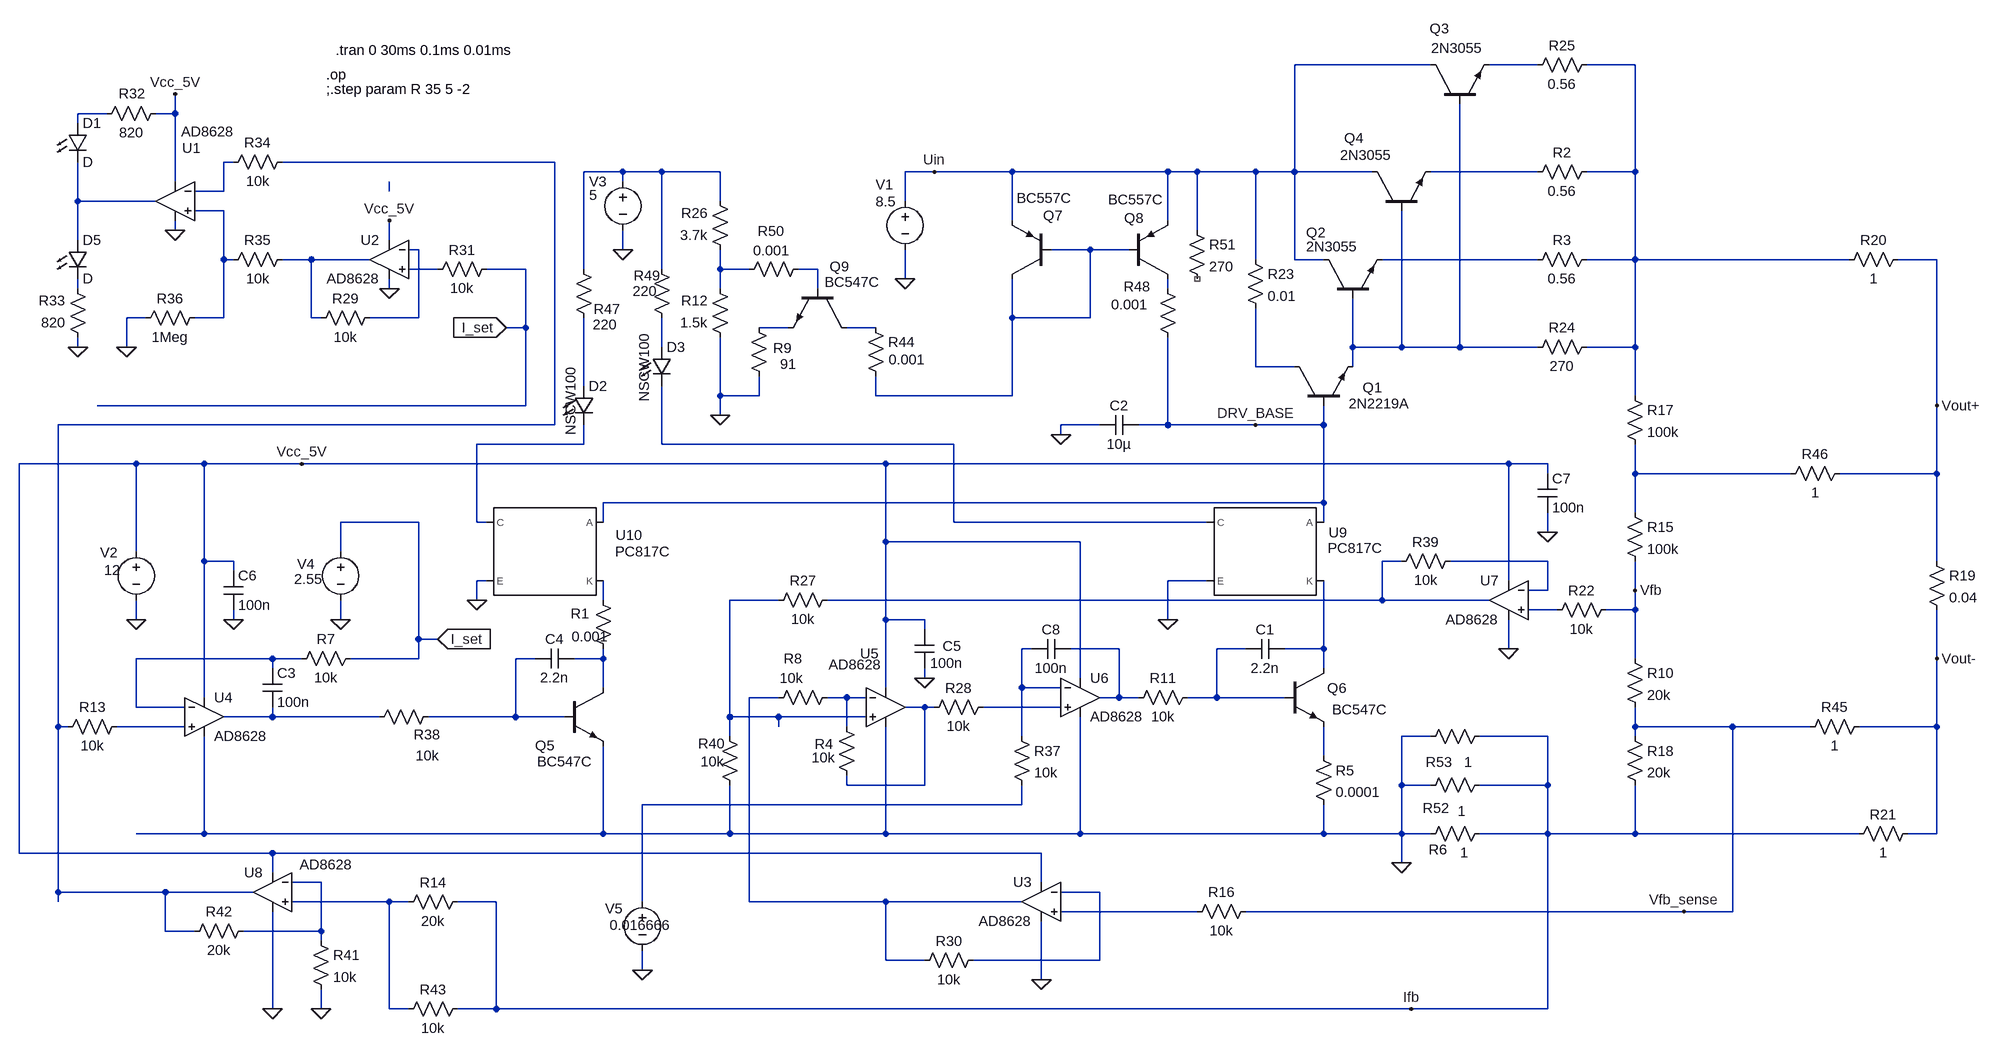
[diagram p0: schematic PSU1.17_LowSide_CurrentLimit_optoUIreg.asc]
PSU1.17_LowSide_CurrentLimit_optoUIreg.asc, the LTspice schematic file:
Version 4
SHEET 1 1588 1488
WIRE 352 -112 128 -112
WIRE 528 -112 448 -112
WIRE 688 -112 608 -112
WIRE -1824 -32 -1872 -32
WIRE -1712 -32 -1712 -64
WIRE -1712 -32 -1744 -32
WIRE -1872 -16 -1872 -32
WIRE -1616 48 -1632 48
WIRE -1088 48 -1536 48
WIRE -976 64 -1040 64
WIRE -912 64 -976 64
WIRE -816 64 -912 64
WIRE -464 64 -512 64
WIRE -336 64 -464 64
WIRE -80 64 -336 64
WIRE -32 64 -80 64
WIRE 64 64 -32 64
WIRE 128 64 128 -112
WIRE 128 64 64 64
WIRE 256 64 128 64
WIRE 528 64 352 64
WIRE 688 64 688 -112
WIRE 688 64 608 64
WIRE -1712 80 -1712 -32
WIRE -976 80 -976 64
WIRE -1632 96 -1632 48
WIRE -1632 96 -1680 96
WIRE -1360 96 -1360 80
WIRE -1872 112 -1872 48
WIRE -1744 112 -1872 112
WIRE -816 112 -816 64
WIRE -512 112 -512 64
WIRE -1632 128 -1680 128
WIRE -336 144 -336 64
WIRE -80 144 -80 64
WIRE -1712 160 -1712 144
WIRE -32 160 -32 64
WIRE -1872 176 -1872 112
WIRE -1360 176 -1360 144
WIRE -1312 192 -1328 192
WIRE -976 192 -976 160
WIRE -208 192 -272 192
WIRE -144 192 -208 192
WIRE -1632 208 -1632 128
WIRE -1616 208 -1632 208
WIRE -1488 208 -1536 208
WIRE -1392 208 -1488 208
WIRE 64 208 64 64
WIRE 128 208 128 64
WIRE 176 208 128 208
WIRE 528 208 272 208
WIRE 688 208 688 64
WIRE 688 208 608 208
WIRE 1040 208 688 208
WIRE 1184 208 1120 208
WIRE -1280 224 -1328 224
WIRE -1136 224 -1200 224
WIRE -1040 224 -1040 64
WIRE -912 224 -912 64
WIRE -816 224 -816 192
WIRE -768 224 -816 224
WIRE -656 224 -688 224
WIRE -512 240 -512 192
WIRE -1872 256 -1872 240
WIRE -1360 256 -1360 240
WIRE -816 256 -816 224
WIRE -656 256 -656 224
WIRE -80 256 -80 240
WIRE -1760 304 -1792 304
WIRE -1632 304 -1632 208
WIRE -1632 304 -1680 304
WIRE -1488 304 -1488 208
WIRE -1472 304 -1488 304
WIRE -1312 304 -1312 192
WIRE -1312 304 -1392 304
WIRE -336 304 -336 240
WIRE -208 304 -208 192
WIRE -208 304 -336 304
WIRE -1136 320 -1136 224
WIRE -1136 320 -1168 320
WIRE -704 320 -752 320
WIRE -560 320 -608 320
WIRE -1872 352 -1872 336
WIRE -1792 352 -1792 304
WIRE -912 352 -912 304
WIRE 224 352 224 272
WIRE 304 352 304 128
WIRE 304 352 224 352
WIRE 400 352 400 -48
WIRE 400 352 304 352
WIRE 528 352 400 352
WIRE 688 352 688 208
WIRE 688 352 608 352
WIRE 64 384 64 288
WIRE 128 384 64 384
WIRE 224 384 224 352
WIRE -1040 416 -1040 304
WIRE -816 432 -816 336
WIRE -752 432 -752 400
WIRE -752 432 -816 432
WIRE -560 432 -560 400
WIRE -336 432 -336 304
WIRE -336 432 -560 432
WIRE 688 432 688 352
WIRE -1136 448 -1136 320
WIRE -1136 448 -1840 448
WIRE 1184 448 1184 208
WIRE -816 464 -816 432
WIRE -1088 480 -1088 48
WIRE -1088 480 -1904 480
WIRE -192 480 -256 480
WIRE -80 480 -80 336
WIRE -80 480 -128 480
WIRE 64 480 -80 480
WIRE 176 480 176 448
WIRE 176 480 64 480
WIRE -256 496 -256 480
WIRE -1040 512 -1040 480
WIRE -1040 512 -1216 512
WIRE -912 512 -912 416
WIRE -432 512 -912 512
WIRE -1776 544 -1968 544
WIRE -1664 544 -1776 544
WIRE -1504 544 -1664 544
WIRE -544 544 -1504 544
WIRE 480 544 -544 544
WIRE 544 544 480 544
WIRE 544 560 544 544
WIRE 688 560 688 512
WIRE 944 560 688 560
WIRE 1184 560 1184 448
WIRE 1184 560 1024 560
WIRE 176 608 176 480
WIRE 176 608 -1008 608
WIRE 688 624 688 560
WIRE -1312 640 -1440 640
WIRE -1216 640 -1216 512
WIRE -1200 640 -1216 640
WIRE -1008 640 -1008 608
WIRE -432 640 -432 512
WIRE -16 640 -432 640
WIRE 176 640 176 608
WIRE 544 656 544 624
WIRE -544 672 -544 544
WIRE -224 672 -544 672
WIRE -1776 688 -1776 544
WIRE -1440 688 -1440 640
WIRE -1664 704 -1664 544
WIRE -1616 704 -1664 704
WIRE 304 704 272 704
WIRE 544 704 384 704
WIRE 1184 704 1184 560
WIRE -1616 720 -1616 704
WIRE -1200 736 -1216 736
WIRE -16 736 -80 736
WIRE 480 736 480 544
WIRE 544 752 544 704
WIRE 544 752 512 752
WIRE 688 752 688 704
WIRE -1216 768 -1216 736
WIRE -1008 768 -1008 736
WIRE -720 768 -800 768
WIRE 272 768 272 704
WIRE 272 768 -640 768
WIRE 448 768 272 768
WIRE 560 784 512 784
WIRE 688 784 688 752
WIRE 688 784 640 784
WIRE -1776 800 -1776 768
WIRE -1616 800 -1616 784
WIRE -1440 800 -1440 768
WIRE -544 800 -544 672
WIRE -480 800 -544 800
WIRE -80 800 -80 736
WIRE -480 816 -480 800
WIRE -1312 832 -1312 640
WIRE -1280 832 -1312 832
WIRE -304 848 -320 848
WIRE -160 848 -240 848
WIRE 48 848 0 848
WIRE 176 848 176 736
WIRE 176 848 112 848
WIRE 480 848 480 800
WIRE -1552 864 -1776 864
WIRE -1504 864 -1552 864
WIRE -1312 864 -1312 832
WIRE -1312 864 -1424 864
WIRE -1120 864 -1152 864
WIRE -1008 864 -1008 848
WIRE -1008 864 -1056 864
WIRE 688 864 688 784
WIRE 1184 864 1184 784
WIRE -1552 880 -1552 864
WIRE 176 880 176 848
WIRE -480 896 -480 880
WIRE -224 896 -224 672
WIRE -1008 912 -1008 864
WIRE -544 912 -544 800
WIRE -320 912 -320 848
WIRE -256 912 -320 912
WIRE -1664 928 -1664 704
WIRE -720 928 -768 928
WIRE -608 928 -640 928
WIRE -576 928 -608 928
WIRE -160 928 -160 848
WIRE -160 928 -192 928
WIRE -128 928 -160 928
WIRE 0 928 0 848
WIRE 0 928 -48 928
WIRE 112 928 0 928
WIRE -1776 944 -1776 864
WIRE -1696 944 -1776 944
WIRE -480 944 -512 944
WIRE -464 944 -480 944
WIRE -256 944 -384 944
WIRE -1552 960 -1552 944
WIRE -1552 960 -1632 960
WIRE -1376 960 -1552 960
WIRE -1152 960 -1152 864
WIRE -1152 960 -1296 960
WIRE -1072 960 -1152 960
WIRE -800 960 -800 768
WIRE -720 960 -800 960
WIRE -576 960 -720 960
WIRE -1904 976 -1904 480
WIRE -1888 976 -1904 976
WIRE -1696 976 -1808 976
WIRE -720 976 -720 960
WIRE -608 976 -608 928
WIRE 688 976 688 944
WIRE 848 976 688 976
WIRE 976 976 848 976
WIRE 1184 976 1184 864
WIRE 1184 976 1056 976
WIRE -800 992 -800 960
WIRE -320 992 -320 912
WIRE 352 992 304 992
WIRE 544 992 432 992
WIRE 688 992 688 976
WIRE 176 1024 176 976
WIRE -608 1072 -608 1056
WIRE -480 1072 -480 944
WIRE -480 1072 -608 1072
WIRE 304 1072 304 992
WIRE 352 1072 304 1072
WIRE 544 1072 544 992
WIRE 544 1072 432 1072
WIRE -320 1104 -320 1072
WIRE -320 1104 -944 1104
WIRE -1664 1152 -1664 992
WIRE -1664 1152 -1776 1152
WIRE -1008 1152 -1008 1008
WIRE -1008 1152 -1664 1152
WIRE -800 1152 -800 1072
WIRE -800 1152 -1008 1152
WIRE -544 1152 -544 976
WIRE -544 1152 -800 1152
WIRE -224 1152 -224 960
WIRE -224 1152 -544 1152
WIRE 176 1152 176 1104
WIRE 176 1152 -224 1152
WIRE 304 1152 304 1072
WIRE 304 1152 176 1152
WIRE 352 1152 304 1152
WIRE 544 1152 544 1072
WIRE 544 1152 432 1152
WIRE 688 1152 688 1072
WIRE 688 1152 544 1152
WIRE 1056 1152 688 1152
WIRE 1184 1152 1184 976
WIRE 1184 1152 1136 1152
WIRE -1968 1184 -1968 544
WIRE -1552 1184 -1968 1184
WIRE -288 1184 -1552 1184
WIRE 304 1200 304 1152
WIRE -1552 1216 -1552 1184
WIRE -1472 1232 -1520 1232
WIRE -288 1232 -288 1184
WIRE -1904 1248 -1904 976
WIRE -1728 1248 -1904 1248
WIRE -1584 1248 -1728 1248
WIRE -192 1248 -256 1248
WIRE -1904 1264 -1904 1248
WIRE -1360 1264 -1520 1264
WIRE -1328 1264 -1360 1264
WIRE -1184 1264 -1248 1264
WIRE -944 1264 -944 1104
WIRE -768 1264 -768 928
WIRE -544 1264 -768 1264
WIRE -320 1264 -544 1264
WIRE -32 1280 -256 1280
WIRE 768 1280 48 1280
WIRE 848 1280 848 976
WIRE 848 1280 768 1280
WIRE -1728 1312 -1728 1248
WIRE -1680 1312 -1728 1312
WIRE -1472 1312 -1472 1232
WIRE -1472 1312 -1600 1312
WIRE -1472 1328 -1472 1312
WIRE -544 1360 -544 1264
WIRE -480 1360 -544 1360
WIRE -192 1360 -192 1248
WIRE -192 1360 -400 1360
WIRE -944 1376 -944 1344
WIRE -288 1392 -288 1296
WIRE -1552 1440 -1552 1280
WIRE -1472 1440 -1472 1408
WIRE -1360 1440 -1360 1264
WIRE -1328 1440 -1360 1440
WIRE -1184 1440 -1184 1264
WIRE -1184 1440 -1248 1440
WIRE 320 1440 -1184 1440
WIRE 544 1440 544 1152
WIRE 544 1440 320 1440
FLAG -512 240 0
FLAG -464 64 Uin
FLAG -1872 352 0
FLAG -1360 256 0
FLAG -1712 160 0
FLAG -1280 832 I_set
IOPIN -1280 832 In
FLAG -1168 320 I_set
IOPIN -1168 320 In
FLAG -1792 352 0
FLAG -1776 800 0
FLAG -1440 800 0
FLAG -944 1376 0
FLAG -1504 544 Vcc_5V
FLAG -1712 -64 Vcc_5V
FLAG -1360 144 Vcc_5V
FLAG -1616 800 0
FLAG -480 896 0
FLAG 480 848 0
FLAG 544 656 0
FLAG -1472 1440 0
FLAG -1552 1440 0
FLAG -288 1392 0
FLAG 304 1200 0
FLAG -976 192 0
FLAG -816 464 0
FLAG -1216 768 0
FLAG -80 800 0
FLAG -256 496 0
FLAG 1184 448 Vout+
FLAG 1184 864 Vout-
FLAG 688 752 Vfb
FLAG 768 1280 Vfb_sense
FLAG 320 1440 Ifb
FLAG 64 480 DRV_BASE
DATAFLAG -368 1152 ""
DATAFLAG 400 352 ""
DATAFLAG -1872 96 ""
DATAFLAG -1152 224 ""
DATAFLAG -1632 272 ""
DATAFLAG -1632 80 ""
DATAFLAG -1488 240 ""
DATAFLAG -1296 544 ""
DATAFLAG -1232 960 ""
DATAFLAG -1312 864 ""
DATAFLAG -1712 864 ""
DATAFLAG -608 928 ""
DATAFLAG -800 832 ""
DATAFLAG 800 208 ""
DATAFLAG -1904 1056 ""
DATAFLAG -432 1104 ""
DATAFLAG 688 832 ""
DATAFLAG -64 64 ""
DATAFLAG -688 1264 ""
DATAFLAG -352 768 ""
DATAFLAG -1776 976 ""
DATAFLAG -352 944 ""
DATAFLAG 64 928 ""
DATAFLAG -304 912 ""
DATAFLAG 176 608 ""
DATAFLAG -1264 48 ""
DATAFLAG -480 1040 ""
DATAFLAG -816 224 ""
DATAFLAG -688 512 ""
DATAFLAG -1040 352 ""
DATAFLAG 496 1152 ""
DATAFLAG -1216 592 ""
DATAFLAG 688 352 ""
DATAFLAG -112 1280 ""
DATAFLAG 336 1280 ""
DATAFLAG -192 1360 ""
DATAFLAG 1184 560 ""
DATAFLAG 1184 976 ""
DATAFLAG 848 976 ""
SYMBOL npn 128 448 R270
WINDOW 0 29 112 VRight 2
WINDOW 3 3 89 VRight 2
SYMATTR InstName Q1
SYMATTR Value 2N2219A
SYMBOL npn 176 272 R270
WINDOW 0 108 -29 VRight 2
WINDOW 3 85 -29 VRight 2
SYMATTR InstName Q2
SYMATTR Value 2N3055
SYMBOL npn 256 128 R270
WINDOW 0 119 -46 VRight 2
WINDOW 3 91 -53 VRight 2
SYMATTR InstName Q4
SYMATTR Value 2N3055
SYMBOL res 512 80 R270
WINDOW 0 32 56 VTop 2
WINDOW 3 0 56 VBottom 2
SYMATTR InstName R2
SYMATTR Value 0.56
SYMATTR SpiceLine tol=1 pwr=5
SYMBOL npn 112 880 R0
WINDOW 0 70 33 Left 2
WINDOW 3 78 68 Left 2
SYMATTR InstName Q6
SYMATTR Value BC547C
SYMBOL cap 112 832 R90
WINDOW 0 0 32 VBottom 2
WINDOW 3 32 32 VTop 2
SYMATTR InstName C1
SYMATTR Value 2.2n
SYMATTR SpiceLine V=50 Irms=130m Rser=1.80898 Lser=0 mfg="KEMET" pn="C0402C222K5RAC" type="X7R"
SYMBOL cap -128 464 R90
WINDOW 0 0 32 VBottom 2
WINDOW 3 32 32 VTop 2
SYMATTR InstName C2
SYMATTR Value 10µ
SYMATTR SpiceLine V=25 Irms=9.88 Rser=0.00384339 Lser=0
SYMBOL res 672 848 R0
SYMATTR InstName R10
SYMATTR Value 20k
SYMATTR SpiceLine pwr=1
SYMBOL voltage -512 96 R0
WINDOW 123 0 0 Left 0
WINDOW 39 24 124 Left 2
WINDOW 0 -48 -11 Left 2
WINDOW 3 -48 17 Left 2
SYMATTR InstName V1
SYMATTR Value 8.5
SYMBOL res 672 608 R0
SYMATTR InstName R15
SYMATTR Value 100k
SYMATTR SpiceLine pwr=1
SYMBOL res 1168 688 R0
SYMATTR InstName R19
SYMATTR Value 0.04
SYMATTR SpiceLine pwr=50
SYMBOL res 512 224 R270
WINDOW 0 32 56 VTop 2
WINDOW 3 0 56 VBottom 2
SYMATTR InstName R3
SYMATTR Value 0.56
SYMATTR SpiceLine tol=1 pwr=5
SYMBOL npn -1072 912 R0
WINDOW 0 -48 95 Left 2
WINDOW 3 -45 122 Left 2
SYMATTR InstName Q5
SYMATTR Value BC547C
SYMBOL res -1024 752 R0
WINDOW 0 -38 38 Left 2
WINDOW 3 -36 76 Left 2
SYMATTR InstName R1
SYMATTR Value 0.001
SYMBOL res 512 368 R270
WINDOW 0 32 56 VTop 2
WINDOW 3 0 56 VBottom 2
SYMATTR InstName R24
SYMATTR Value 270
SYMATTR SpiceLine pwr=0.5
SYMBOL res 48 192 R0
SYMATTR InstName R23
SYMATTR Value 0.01
SYMBOL res -624 752 R90
WINDOW 0 0 56 VBottom 2
WINDOW 3 32 56 VTop 2
SYMATTR InstName R27
SYMATTR Value 10k
SYMBOL npn 352 -48 R270
WINDOW 0 123 -2 VRight 2
WINDOW 3 91 1 VRight 2
SYMATTR InstName Q3
SYMATTR Value 2N3055
SYMBOL res 624 -128 R90
WINDOW 0 0 56 VBottom 2
WINDOW 3 32 56 VTop 2
SYMATTR InstName R25
SYMATTR Value 0.56
SYMATTR SpiceLine pwr=5
SYMBOL Opamps\\AD8628 -1712 48 M0
WINDOW 0 -42 -23 Left 2
WINDOW 3 -97 -50 Left 2
SYMATTR InstName U1
SYMBOL Opamps\\AD8628 -1360 144 M0
SYMATTR InstName U2
SYMBOL res -1376 288 R90
WINDOW 0 0 56 VBottom 2
WINDOW 3 32 56 VTop 2
SYMATTR InstName R29
SYMATTR Value 10k
SYMBOL res -1184 208 R90
WINDOW 0 0 56 VBottom 2
WINDOW 3 32 56 VTop 2
SYMATTR InstName R31
SYMATTR Value 10k
SYMBOL res -1728 -48 R90
WINDOW 0 -1 55 VBottom 2
WINDOW 3 32 56 VTop 2
SYMATTR InstName R32
SYMATTR Value 820
SYMBOL res -1856 352 R180
WINDOW 0 36 76 Left 2
WINDOW 3 36 40 Left 2
SYMATTR InstName R33
SYMATTR Value 820
SYMBOL LED -1888 -16 R0
SYMATTR InstName D1
SYMBOL LED -1888 176 R0
SYMATTR InstName D5
SYMBOL res -1520 32 R90
WINDOW 0 0 56 VBottom 2
WINDOW 3 32 56 VTop 2
SYMATTR InstName R34
SYMATTR Value 10k
SYMBOL res -1520 192 R90
WINDOW 0 0 56 VBottom 2
WINDOW 3 32 56 VTop 2
SYMATTR InstName R35
SYMATTR Value 10k
SYMBOL res -1664 288 R90
WINDOW 0 0 56 VBottom 2
WINDOW 3 32 56 VTop 2
SYMATTR InstName R36
SYMATTR Value 1Meg
SYMBOL voltage -1776 672 R0
WINDOW 123 0 0 Left 0
WINDOW 39 24 124 Left 2
WINDOW 0 -59 18 Left 2
WINDOW 3 -53 47 Left 2
SYMATTR InstName V2
SYMATTR Value 12
SYMBOL voltage -1440 672 R0
WINDOW 123 0 0 Left 0
WINDOW 39 44 38 Left 2
WINDOW 0 -71 37 Left 2
WINDOW 3 -76 62 Left 2
SYMATTR InstName V4
SYMATTR Value 2.55
SYMBOL voltage -944 1248 R0
WINDOW 0 -61 27 Left 2
WINDOW 3 -54 54 Left 2
WINDOW 123 0 0 Left 0
WINDOW 39 -131 118 Left 2
SYMATTR InstName V5
SYMATTR Value 0.016666
SYMBOL res -32 912 R90
WINDOW 0 0 56 VBottom 2
WINDOW 3 32 56 VTop 2
SYMATTR InstName R11
SYMATTR Value 10k
SYMBOL res -1280 944 R90
WINDOW 0 61 18 VBottom 2
WINDOW 3 64 17 VTop 2
SYMATTR InstName R38
SYMATTR Value 10k
SYMBOL Opamps\\AD8628 -1664 896 R0
SYMATTR InstName U4
SYMBOL res -1408 848 R90
WINDOW 0 0 56 VBottom 2
WINDOW 3 32 56 VTop 2
SYMATTR InstName R7
SYMATTR Value 10k
SYMBOL Opamps\\AD8628 -544 880 R0
WINDOW 0 -42 -24 Left 2
WINDOW 3 -94 -6 Left 2
SYMATTR InstName U5
SYMBOL res -624 912 R90
WINDOW 0 -32 72 VBottom 2
WINDOW 3 -31 75 VTop 2
SYMATTR InstName R8
SYMATTR Value 10k
SYMBOL cap -496 816 R0
WINDOW 0 46 28 Left 2
WINDOW 3 25 56 Left 2
SYMATTR InstName C5
SYMATTR Value 100n
SYMBOL cap -1632 720 R0
SYMATTR InstName C6
SYMATTR Value 100n
SYMBOL pnp -272 240 R180
WINDOW 0 -19 104 Left 2
WINDOW 3 -34 133 Left 2
SYMATTR InstName Q7
SYMATTR Value BC557C
SYMBOL res -1792 960 R90
WINDOW 0 0 56 VBottom 2
WINDOW 3 32 56 VTop 2
SYMATTR InstName R13
SYMATTR Value 10k
SYMBOL Opamps\\AD8628 -224 864 R0
SYMATTR InstName U6
SYMBOL res -368 928 R90
WINDOW 0 0 56 VBottom 2
WINDOW 3 32 56 VTop 2
SYMATTR InstName R28
SYMATTR Value 10k
SYMBOL res -336 976 R0
SYMATTR InstName R37
SYMATTR Value 10k
SYMBOL res -624 960 R0
WINDOW 0 -37 45 Left 2
WINDOW 3 -42 67 Left 2
SYMATTR InstName R4
SYMATTR Value 10k
SYMBOL res 448 1136 R90
WINDOW 0 58 84 VBottom 2
WINDOW 3 32 41 VTop 2
SYMATTR InstName R6
SYMATTR Value 1
SYMBOL Opamps\\AD8628 480 704 M0
SYMATTR InstName U7
SYMBOL res 656 768 R90
WINDOW 0 0 56 VBottom 2
WINDOW 3 32 56 VTop 2
SYMATTR InstName R22
SYMATTR Value 10k
SYMBOL res 400 688 R90
WINDOW 0 0 56 VBottom 2
WINDOW 3 32 56 VTop 2
SYMATTR InstName R39
SYMATTR Value 10k
SYMBOL res -816 976 R0
WINDOW 0 -36 28 Left 2
WINDOW 3 -32 58 Left 2
SYMATTR InstName R40
SYMATTR Value 10k
SYMBOL cap 528 560 R0
SYMATTR InstName C7
SYMATTR Value 100n
SYMBOL res -1232 1248 R90
WINDOW 0 0 56 VBottom 2
WINDOW 3 32 56 VTop 2
SYMATTR InstName R14
SYMATTR Value 20k
SYMBOL Opamps\\AD8628 -1552 1184 M0
WINDOW 3 -132 19 Left 2
SYMATTR InstName U8
SYMBOL res -1488 1312 R0
SYMATTR InstName R41
SYMATTR Value 10k
SYMBOL res -1584 1296 R90
WINDOW 0 0 56 VBottom 2
WINDOW 3 32 56 VTop 2
SYMATTR InstName R42
SYMATTR Value 20k
SYMBOL Opamps\\AD8628 -288 1200 M0
SYMATTR InstName U3
SYMBOL res 64 1264 R90
WINDOW 0 0 56 VBottom 2
WINDOW 3 32 56 VTop 2
SYMATTR InstName R16
SYMATTR Value 10k
SYMBOL res -384 1344 R90
WINDOW 0 0 56 VBottom 2
WINDOW 3 32 56 VTop 2
SYMATTR InstName R30
SYMATTR Value 10k
SYMBOL res -1232 1424 R90
WINDOW 0 0 56 VBottom 2
WINDOW 3 32 56 VTop 2
SYMATTR InstName R43
SYMATTR Value 10k
SYMBOL cap -1056 848 R90
WINDOW 0 0 32 VBottom 2
WINDOW 3 32 32 VTop 2
SYMATTR InstName C4
SYMATTR Value 2.2n
SYMBOL pnp -144 240 M180
WINDOW 0 -8 100 Left 2
WINDOW 3 -34 130 Left 2
SYMATTR InstName Q8
SYMATTR Value BC557C
SYMBOL npn -608 256 R90
WINDOW 0 -36 -4 VRight 2
WINDOW 3 -11 36 VLeft 2
SYMATTR InstName Q9
SYMATTR Value BC547C
SYMBOL voltage -976 64 R0
WINDOW 123 0 0 Left 0
WINDOW 39 0 0 Left 0
WINDOW 0 -55 16 Left 2
WINDOW 3 -55 38 Left 2
SYMATTR InstName V3
SYMATTR Value 5
SYMBOL res -736 416 R180
WINDOW 0 -38 62 Left 2
WINDOW 3 -46 36 Left 2
SYMATTR InstName R9
SYMATTR Value 91
SYMBOL res -800 352 R180
WINDOW 0 36 76 Left 2
WINDOW 3 36 40 Left 2
SYMATTR InstName R12
SYMATTR Value 1.5k
SYMBOL res -800 208 R180
WINDOW 0 36 76 Left 2
WINDOW 3 36 40 Left 2
SYMATTR InstName R26
SYMATTR Value 3.7k
SYMBOL res -576 304 R0
WINDOW 3 37 69 Left 2
SYMATTR Value 0.001
SYMATTR InstName R44
SYMBOL res -672 208 R90
WINDOW 0 -31 60 VBottom 2
WINDOW 3 -30 59 VTop 2
SYMATTR InstName R50
SYMATTR Value 0.001
SYMBOL Optos\\PC817C 80 688 M0
WINDOW 0 -120 -31 Center 2
WINDOW 3 -148 -5 Center 2
SYMATTR InstName U9
SYMBOL LED -1056 416 R0
WINDOW 3 -5 -32 VRight 2
SYMATTR Value NSCW100
SYMATTR InstName D2
SYMBOL res -1056 208 R0
WINDOW 0 32 82 Left 2
WINDOW 3 30 107 Left 2
SYMATTR InstName R47
SYMATTR Value 220
SYMBOL res -96 240 R0
WINDOW 0 -57 13 Left 2
WINDOW 3 -77 42 Left 2
SYMATTR InstName R48
SYMATTR Value 0.001
SYMBOL Optos\\PC817C -1104 688 M0
WINDOW 0 -138 -27 Center 2
WINDOW 3 -161 0 Center 2
SYMATTR InstName U10
SYMBOL res 160 1008 R0
SYMATTR InstName R5
SYMATTR Value 0.0001
SYMBOL res -928 208 R0
WINDOW 0 -30 27 Left 2
WINDOW 3 -32 52 Left 2
SYMATTR InstName R49
SYMATTR Value 220
SYMBOL LED -928 352 R0
WINDOW 3 -12 -23 VRight 2
SYMATTR Value NSCW100
SYMATTR InstName D3
SYMBOL res 672 416 R0
SYMATTR InstName R17
SYMATTR Value 100k
SYMBOL res 672 976 R0
SYMATTR InstName R18
SYMATTR Value 20k
SYMBOL res 1136 192 R90
WINDOW 0 0 56 VBottom 2
WINDOW 3 32 56 VTop 2
SYMATTR InstName R20
SYMATTR Value 1
SYMBOL res 1152 1136 R90
WINDOW 0 0 56 VBottom 2
WINDOW 3 32 56 VTop 2
SYMATTR InstName R21
SYMATTR Value 1
SYMBOL res 1072 960 R90
WINDOW 0 0 56 VBottom 2
WINDOW 3 32 56 VTop 2
SYMATTR InstName R45
SYMATTR Value 1
SYMBOL res 1040 544 R90
WINDOW 0 0 56 VBottom 2
WINDOW 3 32 56 VTop 2
SYMATTR InstName R46
SYMATTR Value 1
SYMBOL res -48 144 R0
SYMATTR InstName R51
SYMATTR Value 270
SYMBOL cap -1568 880 R0
SYMATTR InstName C3
SYMATTR Value 100n
SYMBOL cap -240 832 R90
WINDOW 0 0 32 VBottom 2
WINDOW 3 32 32 VTop 2
SYMATTR InstName C8
SYMATTR Value 100n
SYMBOL res 448 1056 R90
WINDOW 0 70 87 VBottom 2
WINDOW 3 43 45 VTop 2
SYMATTR InstName R52
SYMATTR Value 1
SYMBOL res 448 976 R90
WINDOW 0 74 82 VBottom 2
WINDOW 3 43 34 VTop 2
SYMATTR InstName R53
SYMATTR Value 1
TEXT -1464 -96 Left 2 !.op
TEXT -1464 -72 Left 2 !;.step param R 35 5 -2
TEXT -1448 -136 Left 2 !.tran 0 30ms 0.1ms 0.01ms

The netlist it stands for:
* PSU1.17_LowSide_CurrentLimit_optoUIreg.asc
Q1 N024 DRV_BASE N023 0 2N2219A
Q2 Uin N023 N014 0 2N3055
Q4 Uin N023 N007 0 2N3055
R2 N007 N002 0.56 tol=1 pwr=5
Q6 N037 N036 N047 0 BC547C
C1 N037 N036 2.2n V=50 Irms=130m Rser=1.80898 Lser=0 mfg="KEMET" pn="C0402C222K5RAC" type="X7R"
C2 DRV_BASE 0 10µ V=25 Irms=9.88 Rser=0.00384339 Lser=0
R10 Vfb Vfb_sense 20k pwr=1
V1 Uin 0 8.5
R15 N028 Vfb 100k pwr=1
R19 Vout+ Vout- 0.04 pwr=50
R3 N014 N002 0.56 tol=1 pwr=5
Q5 N040 N039 0 0 BC547C
R1 N031 N040 0.001
R24 N023 N002 270 pwr=0.5
R23 Uin N024 0.01
R27 N029 N032 10k
Q3 Uin N023 N001 0 2N3055
R25 N002 N001 0.56 pwr=5
XU1 N010 N004 Vcc_5V 0 N009 AD8628  ; pins In+ In- V+ V- OUT
XU2 N015 N011 Vcc_5V 0 N013 AD8628  ; pins In+ In- V+ V- OUT
R29 N011 N013 10k
R31 I_set N015 10k
R32 Vcc_5V N003 820
R33 0 N018 820
D1 N003 N009 D
D5 N009 N018 D
R34 N005 N004 10k
R35 N013 N010 10k
R36 N010 0 1Meg
V2 Vcc_5V 0 12
V4 I_set 0 2.55
V5 N048 0 0.016666
R11 N036 N035 10k
R38 N039 N045 10k
XU4 N046 N038 Vcc_5V 0 N045 AD8628  ; pins In+ In- V+ V- OUT
R7 I_set N038 10k
XU5 N032 N042 Vcc_5V 0 N043 AD8628  ; pins In+ In- V+ V- OUT
R8 N042 N041 10k
C5 Vcc_5V 0 100n
C6 Vcc_5V 0 100n
Q7 N012 N012 Uin 0 BC557C
R13 N046 N005 10k
XU6 N044 N034 Vcc_5V 0 N035 AD8628  ; pins In+ In- V+ V- OUT
R28 N044 N043 10k
R37 N034 N048 10k
R4 N042 N043 10k
R6 Ifb 0 1
XU7 N033 N030 Vcc_5V 0 N029 AD8628  ; pins In+ In- V+ V- OUT
R22 Vfb N033 10k
R39 N030 N029 10k
R40 N032 0 10k
C7 Vcc_5V 0 100n
R14 Ifb N051 20k
XU8 N051 N049 Vcc_5V 0 N005 AD8628  ; pins In+ In- V+ V- OUT
R41 N049 0 10k
R42 N049 N005 20k
XU3 N052 N050 Vcc_5V 0 N041 AD8628  ; pins In+ In- V+ V- OUT
R16 Vfb_sense N052 10k
R30 N050 N041 10k
R43 Ifb N051 10k
C4 N040 N039 2.2n
Q8 N019 N012 Uin 0 BC557C
Q9 N021 N017 N020 0 BC547C
V3 N006 0 5
R9 0 N020 91
R12 0 N016 1.5k
R26 N016 N006 3.7k
R44 N021 N012 0.001
R50 N017 N016 0.001
XU9 DRV_BASE N037 N027 0 PC817 Igain=2.3m  ; PC817C, pins A K C E
D2 N025 N026 NSCW100
R47 N006 N025 220
R48 N019 DRV_BASE 0.001
XU10 DRV_BASE N031 N026 0 PC817 Igain=2.3m  ; PC817C, pins A K C E
R5 N047 0 0.0001
R49 N006 N022 220
D3 N022 N027 NSCW100
R17 N002 N028 100k
R18 Vfb_sense Ifb 20k
R20 Vout+ N002 1
R21 Vout- Ifb 1
R45 Vout- Vfb_sense 1
R46 Vout+ N028 1
R51 Uin NC_01 270
C3 N038 N045 100n
C8 N035 N034 100n
R52 Ifb 0 1
R53 Ifb 0 1
.model D D
.lib standard.dio
.model NPN NPN
.model PNP PNP
.lib standard.bjt
.op
;.step param R 35 5 -2
.tran 0 30ms 0.1ms 0.01ms
.lib PC817.sub
.backanno
.end